# Altium project WirelessCommunications.PrjPcb
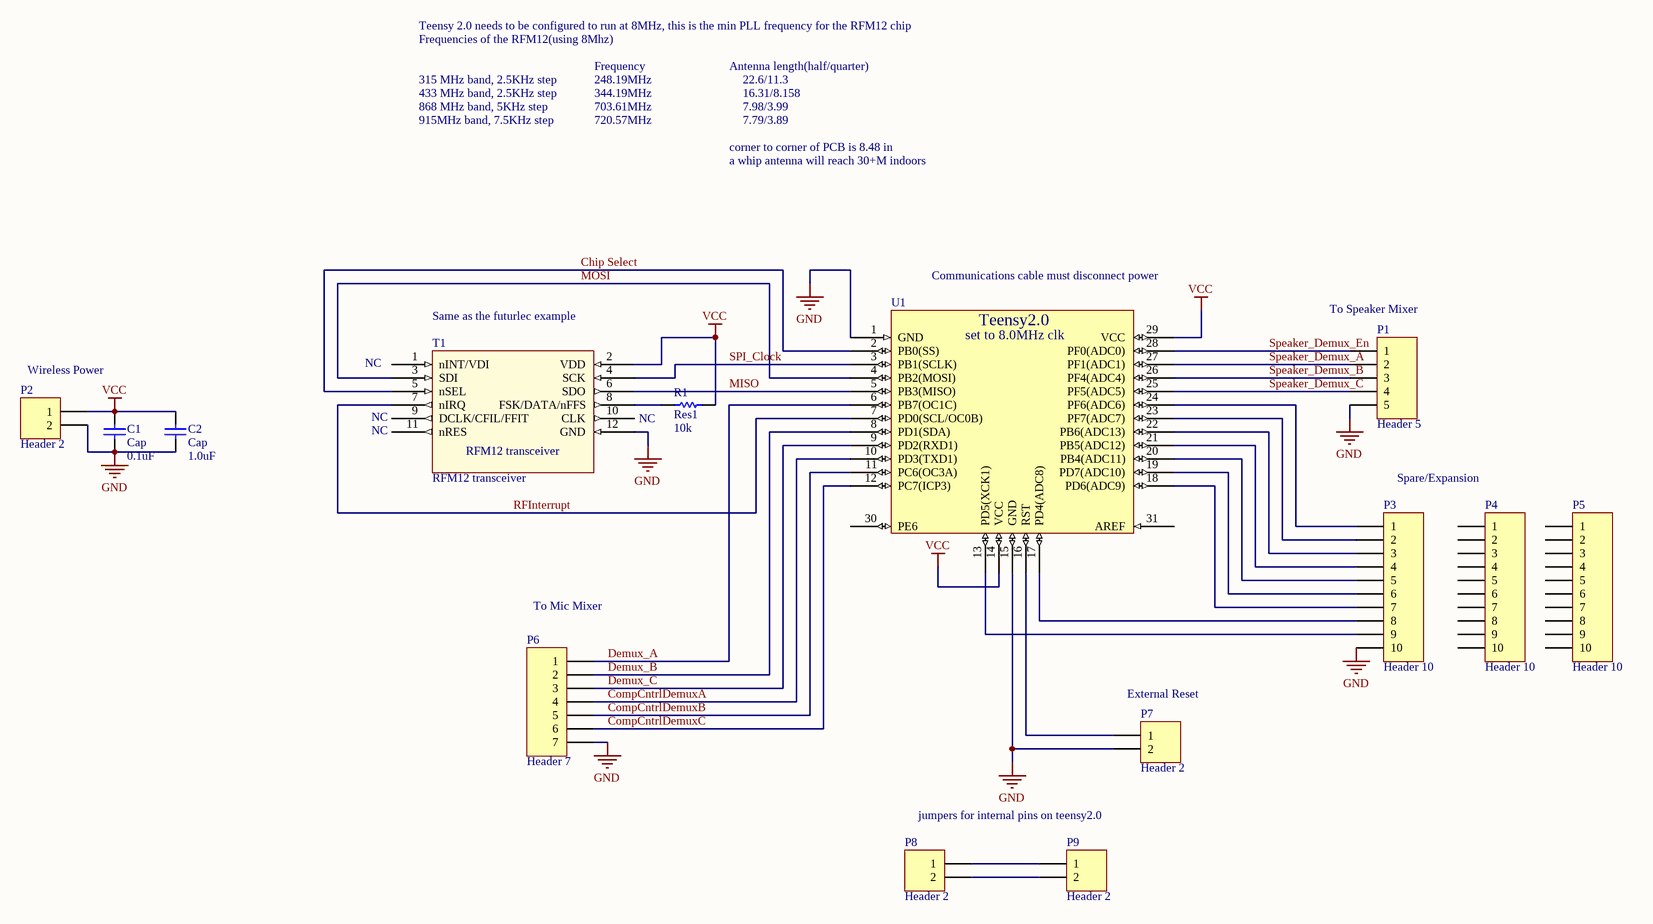
[diagram p0: WirelessCommunications.SchDoc]
1 sheet, 14 parts. Net scope: global (net labels, ports and power ports of the same name join across sheets).
Board file: WirelessCommunications.PcbDoc

## Sheet WirelessCommunications.SchDoc: Wireless Communication Controller
size B; Author: Levi Balling; CompanyName: Smart Home; DrawnBy: Levi Balling; Engineer: Levi Balling; Organization: U of U Computer Engineering; Address1: 50 S. Central Campus Dr.; Address2: Rm. 3280 MEB; Address3: Salt Lake City, UT; Address4: Australia 2086; DocumentNumber: 1; Revision: 1; SheetNumber: 11; SheetTotal: 13; Website: www.eng.utah.edu/~lballing/SmartHome; Project: Smart Home; Description: This board will control a Mic Mixer system, Speaker Mixer System, and communicate wirelessly to other RF modules; ProjectName: Smart Home

### Parts
C1  Cap  value 0.1uF  [RAD-0.3]
C2  Cap  value 1.0uF  [RAD-0.3]
P1  Header 5  [HDR1X5]
P2  Header 2  [HDR1X2]
P3  Header 10  [HDR1X10]
P4  Header 10  [HDR1X10]
P5  Header 10  [HDR1X10]
P6  Header 7  [HDR1X7]
P7  Header 2  [HDR1X2]
P8  Header 2  [HDR1X2]
P9  Header 2  [HDR1X2]
R1  Res1  value 10k  [AXIAL-0.3]
T1  RFM12 transceiver  [RFM12-transceiver]
U1  Teensy  [Teensy2.0]  (value not drawn)

### Nets
GND: C1.1 C2.1 P1.5 P2.2 P3.10 P6.7 P7.2 T1.12(GND) U1.1(GND) U1.15(GND)
VCC: C1.2 C2.2 P2.1 R1.1 T1.2(VDD) U1.14(VCC) U1.29(VCC)
Chip Select: T1.5(nSEL) U1.2(PB0(SS))
CompCntrlDemuxA: P6.4 U1.10(PD3(TXD1))
CompCntrlDemuxB: P6.5 U1.11(PC6(OC3A))
CompCntrlDemuxC: P6.6 U1.12(PC7(ICP3))
Demux_A: P6.1 U1.6(PB7(OC1C))
Demux_B: P6.2 U1.8(PD1(SDA))
Demux_C: P6.3 U1.9(PD2(RXD1))
MISO: T1.6(SDO) U1.5(PB3(MISO))
MOSI: T1.3(SDI) U1.4(PB2(MOSI))
RFInterrupt: T1.7(nIRQ) U1.7(PD0(SCL/OC0B))
Speaker_Demux_A: P1.2 U1.27(PF1(ADC1))
Speaker_Demux_B: P1.3 U1.26(PF4(ADC4))
Speaker_Demux_C: P1.4 U1.25(PF5(ADC5))
Speaker_Demux_En: P1.1 U1.28(PF0(ADC0))
SPI_Clock: T1.4(SCK) U1.3(PB1(SCLK))
NetP3_1: P3.1 U1.24(PF6(ADC6))
NetP3_2: P3.2 U1.23(PF7(ADC7))
NetP3_3: P3.3 U1.22(PB6(ADC13))
NetP3_4: P3.4 U1.21(PB5(ADC12))
NetP3_5: P3.5 U1.20(PB4(ADC11))
NetP3_6: P3.6 U1.19(PD7(ADC10))
NetP3_7: P3.7 U1.18(PD6(ADC9))
NetP3_8: P3.8 U1.17(PD4(ADC8))
NetP3_9: P3.9 U1.13(PD5(XCK1))
NetP7_1: P7.1 U1.16(RST)
NetP8_1: P8.1 P9.1
NetP8_2: P8.2 P9.2
NetR1_2: R1.2 T1.8(FSK/DATA/nFFS)

Not connected (* = marked no-connect by the designer): P4 1 2 3 4 5 6 7 8 9 10; P5 1 2 3 4 5 6 7 8 9 10; T1 1(nINT/VDI) 9(DCLK/CFIL/FFIT) 10(CLK) 11(nRES); U1 30(PE6) 31(AREF)

### Notes on the sheet
- Teensy 2.0 needs to be configured to run at 8MHz, this is the min PLL frequency for the RFM12 chip
- Frequencies of the RFM12(using 8Mhz)
- Frequency
- Antenna length(half/quarter)
- 315 MHz band, 2.5KHz step
- 433 MHz band, 2.5KHz step
- 868 MHz band, 5KHz step
- 915MHz band, 7.5KHz step
- 248.19MHz
- 344.19MHz
- 703.61MHz
- 720.57MHz
- 22.6/11.3
- 16.31/8.158
- 7.98/3.99
- 7.79/3.89
- corner to corner of PCB is 8.48 in
- a whip antenna will reach 30+M indoors
- Communications cable must disconnect power
- (near T1) Same as the futurlec example
- (near P1) To Speaker Mixer
- Wireless Power
- NC
- (near T1) NC
- (near R1) NC
- Spare/Expansion
- (near P6) To Mic Mixer
- (near P7) External Reset
- jumpers for internal pins on teensy2.0
- Date:
- Time:
- Engineer:
- Drawn By:
- Checked By:
- Title
- Size:
- File:
- B
- Number:
- Revision:
- Project:
- Sheet
- of
- Website:
- (in symbol Teensy2.0) set to 8.0MHz clk

### Library data of the parts
C1 C2 = Cap: Capacitor; Vendor: Taydaelectronics; Published: 8-Jun-2000; LatestRevisionDate: 17-Jul-2002; LatestRevisionNote: Re-released for DXP Platform.; PackageReference: RAD-0.3; Publisher: Altium Limited; PackageDescription: Radial Cap, Thru-Hole; 2 Leads; 0.3 in Pin Spacing; Price: 0.03
P1 = Header 5: Header, 5-Pin; Vendor: Taydaelectronics; LatestRevisionDate: 17-Jul-2002; LatestRevisionNote: Re-released for DXP Platform.; Publisher: Altium Limited; Price: 0.05; Value: Header 5
P2 P7-P9 = Header 2: Header, 2-Pin; Vendor: Taydaelectronics; LatestRevisionDate: 17-Jul-2002; LatestRevisionNote: Re-released for DXP Platform.; Publisher: Altium Limited; Price: 0.02; Value: Header 2
P3-P5 = Header 10: Header, 10-Pin; Vendor: Taydaelectronics; LatestRevisionDate: 17-Jul-2002; LatestRevisionNote: Re-released for DXP Platform.; Publisher: Altium Limited; Price: 0.10; Value: Header 10
P6 = Header 7: Header, 7-Pin; Vendor: Taydaelectronics; LatestRevisionDate: 17-Jul-2002; LatestRevisionNote: Re-released for DXP Platform.; Publisher: Altium Limited; Price: 0.07; Value: Header 7
R1 = Res1: Resistor; Vendor: Taydaelectronics; Published: 8-Jun-2000; LatestRevisionDate: 17-Jul-2002; LatestRevisionNote: Re-released for DXP Platform.; PackageReference: AXIAL-0.3; Publisher: Altium Limited; PackageDescription: Axial Device, Thru-Hole; 2 Leads; 0.3 in Pin Spacing; Price: 0.01
T1 = RFM12 transceiver: www.futurlec.com 433 MHZ transceiver; Price: 7.90; Vendor: futurlec; Value: RFM12 transceiver
U1 = Teensy2.0: The teensy 2.0 from www.PJRC.com, chang clock to 8MHz; Vendor: PJRC; Price: 16.00; Value: Teensy2.0